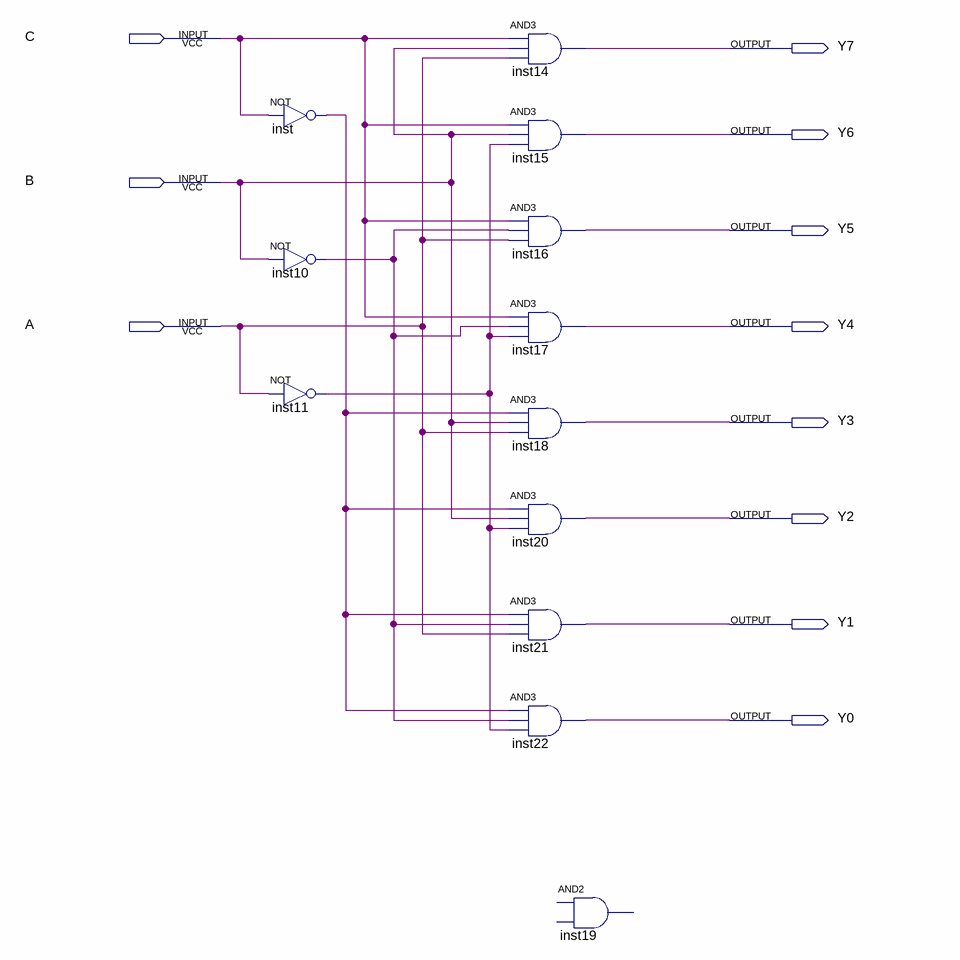
[diagram p0: schematic sheet]
// Quartus schematic 138.bdf as structural Verilog: 12 symbols, 11 pins
module \138  (
  input  C,
  input  B,
  input  A,
  output Y7,
  output Y6,
  output Y5,
  output Y4,
  output Y3,
  output Y2,
  output Y1,
  output Y0
);

  wire inst10_out, inst11_out, inst_out;

  not inst (inst_out, C);
  not inst10 (inst10_out, B);
  not inst11 (inst11_out, A);
  and inst14 (Y7, C, B, A);
  and inst15 (Y6, C, B, inst11_out);
  and inst16 (Y5, C, inst10_out, A);
  and inst17 (Y4, C, inst10_out, inst11_out);
  and inst18 (Y3, inst_out, B, A);
  and inst20 (Y2, inst_out, B, inst11_out);
  and inst21 (Y1, inst_out, inst10_out, A);
  and inst22 (Y0, inst_out, inst10_out, inst11_out);
  // AND2 inst19 is placed but not wired
endmodule
